# EAGLE design Touch Pad Board (PCB A) (EAGLE 6.1)
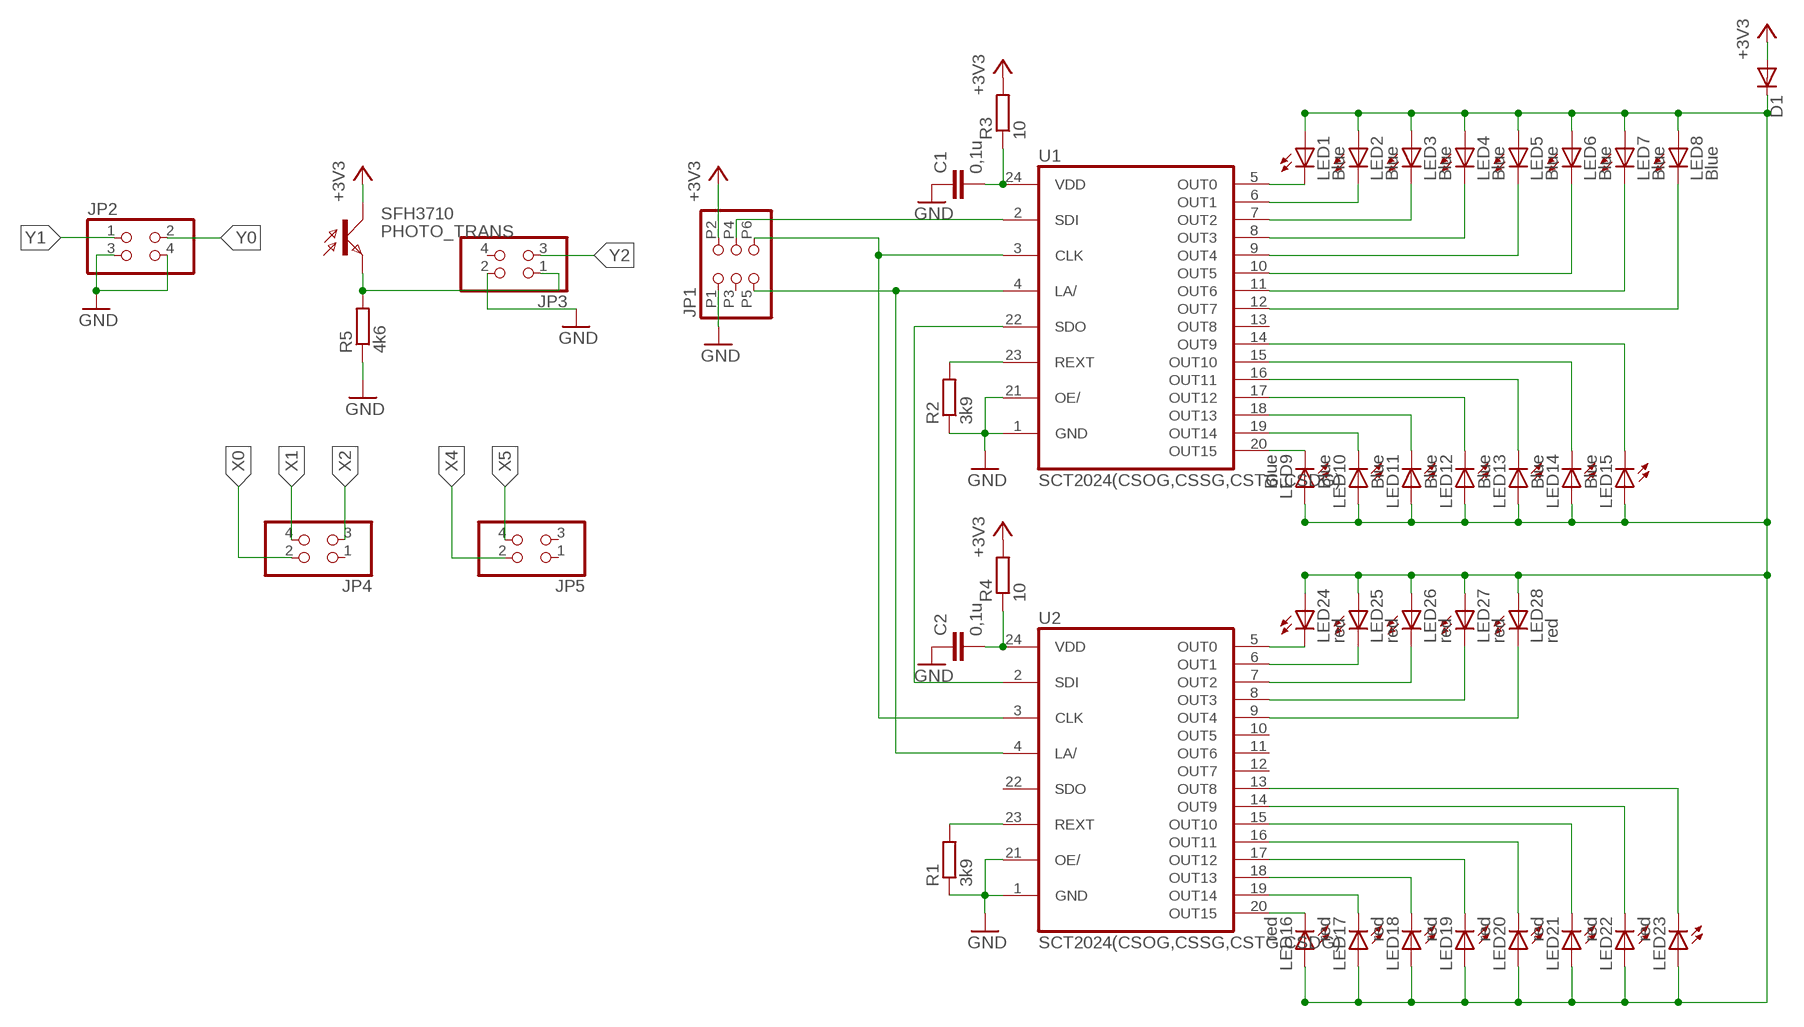
[diagram p0: schematic, sheet 1]

## Parts
C1  0,1u  C-EUC0805  [C0805]
C2  0,1u  C-EUC0805  [C0805]
D1  DIODE-DO214AC  [DO214AC]
JP1  PINHD-2X3SMD  [2X3SMD]
JP2  PINHD-2X2SMD  [2X2SMD]
JP3  PINHD-2X2SMD  [2X2SMD]
JP4  PINHD-2X2SMD  [2X2SMD]
JP5  PINHD-2X2SMD  [2X2SMD]
LED1  Blue  LEDCHIPLED_1206  [CHIPLED_1206]
LED2  Blue  LEDCHIPLED_1206  [CHIPLED_1206]
LED3  Blue  LEDCHIPLED_1206  [CHIPLED_1206]
LED4  Blue  LEDCHIPLED_1206  [CHIPLED_1206]
LED5  Blue  LEDCHIPLED_1206  [CHIPLED_1206]
LED6  Blue  LEDCHIPLED_1206  [CHIPLED_1206]
LED7  Blue  LEDCHIPLED_1206  [CHIPLED_1206]
LED8  Blue  LEDCHIPLED_1206  [CHIPLED_1206]
LED9  Blue  LEDCHIPLED_1206  [CHIPLED_1206]
LED10  Blue  LEDCHIPLED_1206  [CHIPLED_1206]
LED11  Blue  LEDCHIPLED_1206  [CHIPLED_1206]
LED12  Blue  LEDCHIPLED_1206  [CHIPLED_1206]
LED13  Blue  LEDCHIPLED_1206  [CHIPLED_1206]
LED14  Blue  LEDCHIPLED_1206  [CHIPLED_1206]
LED15  Blue  LEDCHIPLED_1206  [CHIPLED_1206]
LED16  red  LEDCHIPLED_1206  [CHIPLED_1206]
LED17  red  LEDCHIPLED_1206  [CHIPLED_1206]
LED18  red  LEDCHIPLED_1206  [CHIPLED_1206]
LED19  red  LEDCHIPLED_1206  [CHIPLED_1206]
LED20  red  LEDCHIPLED_1206  [CHIPLED_1206]
LED21  red  LEDCHIPLED_1206  [CHIPLED_1206]
LED22  red  LEDCHIPLED_1206  [CHIPLED_1206]
LED23  red  LEDCHIPLED_1206  [CHIPLED_1206]
LED24  red  LEDCHIPLED_1206  [CHIPLED_1206]
LED25  red  LEDCHIPLED_1206  [CHIPLED_1206]
LED26  red  LEDCHIPLED_1206  [CHIPLED_1206]
LED27  red  LEDCHIPLED_1206  [CHIPLED_1206]
LED28  red  LEDCHIPLED_1206  [CHIPLED_1206]
R1  3k9  R-EU_R0805  [R0805]
R2  3k9  R-EU_R0805  [R0805]
R3  10  R-EU_R0805  [R0805]
R4  10  R-EU_R0805  [R0805]
R5  4k6  R-EU_R0805  [R0805]
SFH3710  PHOTO_TRANS  [PHOTO_TRANS]
U1  SCT2024(CSOG,CSSG,CSTG,CSDG)  [24SSOP]
U2  SCT2024(CSOG,CSSG,CSTG,CSDG)  [24SSOP]

## Nets
+3V3: D1.A JP1.P2 R3.2 R4.2 SFH3710.A(C)
GND: C1.1 C2.1 JP1.P1 JP2.3 JP2.4 JP3.2 R1.1 R2.1 R5.1 U1.1(GND) U1.21(OE/) U2.1(GND) U2.21(OE/)
LED_DP: D1.C LED1.A LED2.A LED3.A LED4.A LED5.A LED6.A LED7.A LED8.A LED9.A LED10.A LED11.A LED12.A LED13.A LED14.A LED15.A LED16.A LED17.A LED18.A LED19.A LED20.A LED21.A LED22.A LED23.A LED24.A LED25.A LED26.A LED27.A LED28.A
N$1: LED1.C U1.5(OUT0)
N$2: LED2.C U1.6(OUT1)
N$3: LED3.C U1.7(OUT2)
N$4: LED4.C U1.8(OUT3)
N$5: LED5.C U1.9(OUT4)
N$6: LED6.C U1.10(OUT5)
N$7: LED7.C U1.11(OUT6)
N$8: LED8.C U1.12(OUT7)
N$9: LED24.C U2.5(OUT0)
N$10: LED25.C U2.6(OUT1)
N$11: LED26.C U2.7(OUT2)
N$12: LED27.C U2.8(OUT3)
N$13: LED28.C U2.9(OUT4)
N$17: LED16.C U2.20(OUT15)
N$18: LED17.C U2.19(OUT14)
N$19: LED18.C U2.18(OUT13)
N$20: LED19.C U2.17(OUT12)
N$21: LED20.C U2.16(OUT11)
N$22: LED21.C U2.15(OUT10)
N$23: LED22.C U2.14(OUT9)
N$24: LED23.C U2.13(OUT8)
N$25: R1.2 U2.23(REXT)
N$26: LED9.C U1.20(OUT15)
N$27: LED10.C U1.19(OUT14)
N$28: LED11.C U1.18(OUT13)
N$29: LED12.C U1.17(OUT12)
N$30: LED13.C U1.16(OUT11)
N$31: LED14.C U1.15(OUT10)
N$32: LED15.C U1.14(OUT9)
N$33: R2.2 U1.23(REXT)
N$34: U1.22(SDO) U2.2(SDI)
N$35: JP1.P5 U1.4(LA/) U2.4(LA/)
N$36: JP1.P6 U1.3(CLK) U2.3(CLK)
N$37: JP1.P4 U1.2(SDI)
N$38: C1.2 R3.1 U1.24(VDD)
N$39: C2.2 R4.1 U2.24(VDD)
OPTO: JP3.1 R5.2 SFH3710.C(E)
X0: JP4.2
X1: JP4.4
X2: JP4.3
X4: JP5.2
X5: JP5.4
Y0: JP2.2
Y1: JP2.1
Y2: JP3.3
Unconnected: JP1.P3 JP3.4 JP4.1 JP5.1 JP5.3 U1.13(OUT8) U2.10(OUT5) U2.11(OUT6) U2.12(OUT7) U2.22(SDO)

## Library data of the parts
C1 C2 = resistor:C-EU: CAPACITOR, European symbol
D1 = diode:DIODE-: DIODE
JP1 = pinhead:PINHD-2X3: PIN HEADER
JP2-JP5 = pinhead:PINHD-2X2: PIN HEADER
LED1-LED28 = led:LED: LED OSRAM: - CHIPLED LG R971, LG N971, LY N971, LG Q971, LY Q971, LO R971, LY R971 LH N974, LH R974 LS Q976, LO Q976, LY Q976 LO Q996 - Hyper CHIPLED LW Q18S LB Q993, LB Q99A, LB R99A - SideLED LS A670, LO A670, LY A670, LG A670, LP A670 LB A673, LV A673, LT A673, LW A673 LH A674 LY A675 LS A676, LA A676, LO A676, LY A676, LW A676 LS A679, LY A679, LG A679 - Hyper Micro SIDELED® LS Y876, LA Y876, LO Y876, LY Y876 LT Y87S - SmartLED LW L88C, LW L88S LB L89C, LB L89S, LG L890 LS L89K, LO L89K, LY L89K LS L896, LA L896, LO L896, LY L896 - TOPLED LS T670, LO T670, LY T670, LG T670, LP T670 LSG T670, LSP T670, LSY T670, LOP T670, LYG T670 LG T671, LOG T671, LSG T671 LB T673, LV T673, LT T673, LW T673 LH T674 LS T676, LA T676, LO T676, LY T676, LB T676, LH T676, LSB T676, LW T676 LB T67C, LV T67C, LT T67C, LS T67K, LO T67K, LY T67K, LW E67C LS E67B, LA E67B, LO E67B, LY E67B, LB E67C, LV E67C, LT E67C LW T67C LS T679, LY T679, LG T679 LS T770, LO T770, LY T770, LG T770, LP T770 LB T773, LV T773, LT T773, LW T773 LH T774 LS E675, LA E675, LY E675, LS T675 LS T776, LA T776, LO T776, LY T776, LB T776 LHGB T686 LT T68C, LB T68C - Hyper Mini TOPLED® LB M676 - Mini TOPLED Santana® LG M470 LS M47K, LO M47K, LY M47K Source: http://www.osram.convergy.de LUXEON: - LUMILED® LXK2-PW12-R00, LXK2-PW12-S00, LXK2-PW14-U00, LXK2-PW14-V00 LXK2-PM12-R00, LXK2-PM12-S00, LXK2-PM14-U00 LXK2-PE12-Q00, LXK2-PE12-R00, LXK2-PE12-S00, LXK2-PE14-T00, LXK2-PE14-U00 LXK2-PB12-K00, LXK2-PB12-L00, LXK2-PB12-M00, LXK2-PB14-N00, LXK2-PB14-P00, LXK2-PB14-Q00 LXK2-PR12-L00, LXK2-PR12-M00, LXK2-PR14-Q00, LXK2-PR14-R00 LXK2-PD12-Q00, LXK2-PD12-R00, LXK2-PD12-S00 LXK2-PH12-R00, LXK2-PH12-S00 LXK2-PL12-P00, LXK2-PL12-Q00, LXK2-PL12-R00 Source: www.luxeon.com KINGBRIGHT: KA-3528ASYC Source: www.kingbright.com
R1-R5 = resistor:R-EU_: RESISTOR, European symbol
SFH3710 = myHome:PHOTO_TRANS
U1 U2 = myHome:SCT2024(CSOG,CSSG,CSTG,CSDG)

## Board
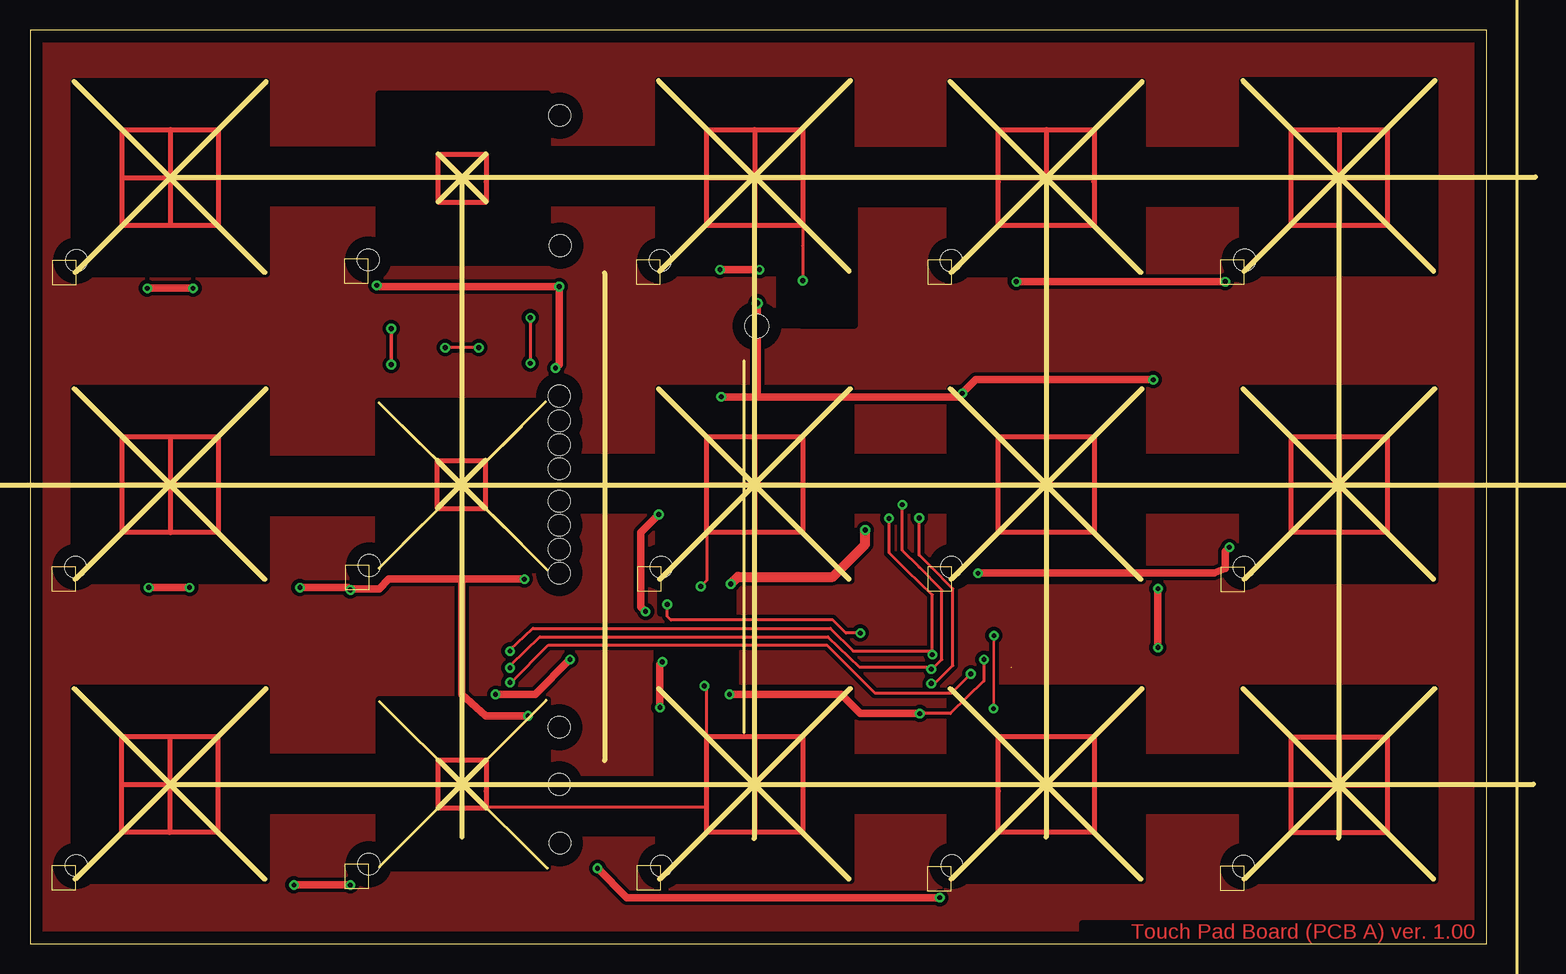
[diagram p1: board, top side]
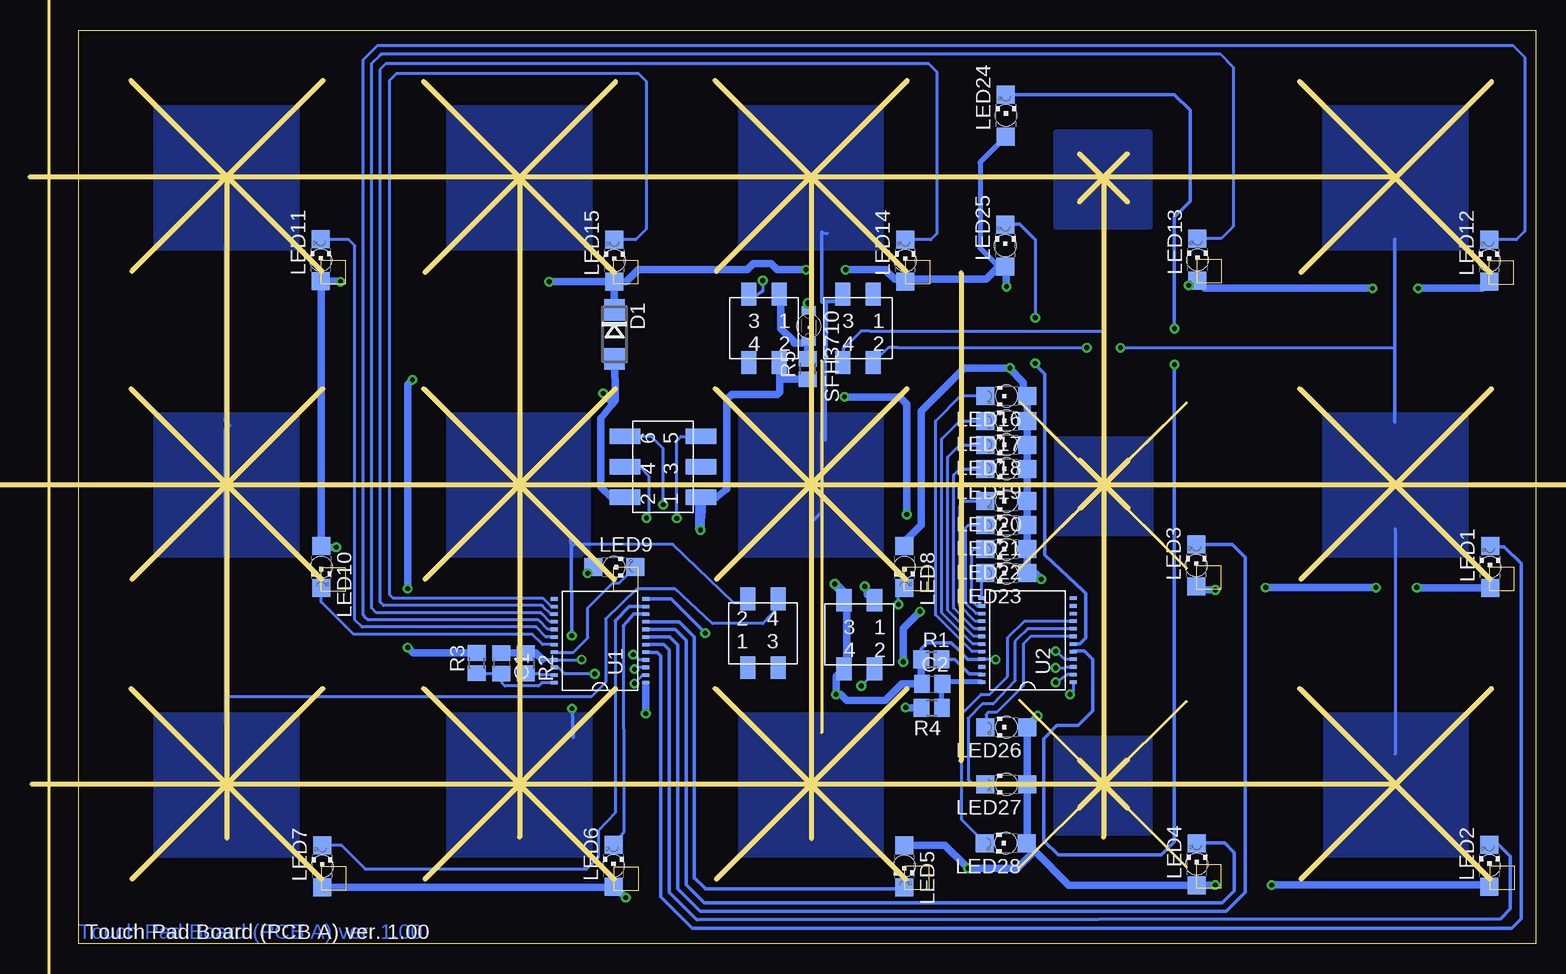
[diagram p2: board, bottom side, seen from below]

Size 121.39 x 76.2 mm. Coordinates in mm from the lower left corner, seen from the top.
Outline: 0,0 121.39,0 121.39,76.2 0,76.2 0,0
Copper layers (1*16): Top 0.035mm / dielectric 1.5mm / Bottom 0.035mm
Design rules: minimum track width 10mil, minimum drill 24mil, track to track 8mil, track to pad 8mil, pad to pad 8mil, via to via 8mil, smd to smd 8mil, copper to edge 40mil, drill to drill 8mil, minimum pad ring 10mil, minimum via ring 8mil, stop-mask expansion 4mil, vias tented up to drill 0mil, thermal gap 10mil
tRestrict: area 18,11.2 to 31.5,15.6; area 29.1,6.3 to 43.1,20.3; area 29.1,31.2 to 43.1,45.2; area 29.1,56.8 to 43.1,70.8; area 3.7,5.3 to 19.7,21.3; area 3.7,30.3 to 19.7,46.3; area 3.7,55.9 to 19.7,71.9; area 52.4,5.3 to 68.4,21.3; area 52.4,30.3 to 68.4,46.3; area 52.4,56 to 68.4,72; area 76.7,55.9 to 92.7,71.9; area 76.7,30.3 to 92.7,46.3; 22 more areas
Milling: area 1.8,4.5 to 3.8,6.5; area 26.2,4.6 to 28.2,6.6; area 50.6,4.5 to 52.6,6.5; area 74.8,4.4 to 76.8,6.4; area 99.2,4.5 to 101.2,6.5; area 1.8,29.4 to 3.8,31.4; area 26.3,29.5 to 28.3,31.5; area 50.6,29.4 to 52.6,31.4; area 74.8,29.4 to 76.8,31.4; area 99.2,29.4 to 101.2,31.4; area 1.9,55 to 3.9,57; area 26.2,55.1 to 28.2,57.1; 3 more areas; 47 lines

### Footprints (pad centres in the part's own frame; a part is rotated, then mirrored left to right if it is on the bottom)
C0805 = smd 1.3 x 1.5: 1 -0.85,0; 2 0.85,0
DO214AC = smd 1.8 x 1.7: A 2.05,0; C -2.05,0
2X3SMD = smd 1.27 x 2.54: P1 -3.175,-3.175; P2 -3.175,3.175; P3 -0.635,-3.175; P4 -0.635,3.175; P5 1.905,-3.175; P6 1.905,3.175
2X2SMD = smd 0.635 x 1.27: 1 -0.635,-2.54; 2 -0.635,2.54; 3 1.905,-2.54; 4 1.905,2.54; P$1 0,2.54; P$2 2.54,2.54; P$4 0,-2.54; P$5 2.54,-2.54; P$9 2.54,3.175; P$10 1.905,3.175; P$11 0,3.175; P$12 -0.635,3.175; P$13 -0.635,-3.175; P$14 0,-3.175; P$15 1.905,-3.175; P$16 2.54,-3.175
CHIPLED_1206 = smd 1.5 x 1.5: A 0,-1.75; C 0,1.75 | hole 1.8: 0,0
R0805 = smd 1.3 x 1.5: 1 -0.85,0; 2 0.85,0
PHOTO_TRANS = smd 1.2 x 1.2: A 0,-1.05; C 0,1.05 | hole 2: 0,0
24SSOP = smd 0.305 x 0.61: 1 -3.493,-3.81; 2 -2.857,-3.81; 3 -2.223,-3.81; 4 -1.587,-3.81; 5 -0.953,-3.81; 6 -0.318,-3.81; 7 0.318,-3.81; 8 0.953,-3.81; 9 1.587,-3.81; 10 2.223,-3.81; 11 2.857,-3.81; 12 3.493,-3.81; 13 3.493,3.81; 14 2.857,3.81; 15 2.223,3.81; 16 1.587,3.81; 17 0.953,3.81; 18 0.318,3.81; 19 -0.318,3.81; 20 -0.953,3.81; 21 -1.587,3.81; 22 -2.223,3.81; 23 -2.857,3.81; 24 -3.493,3.81

### Placement (x,y rotation side)
C1  86.18,23.39 270 bottom
C2  50.3,21.67 0 bottom
D1  76.77,50.83 270 bottom
JP1  72.72,40.42 90 bottom
JP2  55.41,25.8 180 bottom
JP3  63.35,51.33 180 bottom
JP4  55.51,51.33 180 bottom
JP5  65.34,25.89 0 bottom
LED1  3.8,31.41 0 bottom
LED2  3.85,6.53 0 bottom
LED3  28.28,31.55 0 bottom
LED4  28.23,6.65 0 bottom
LED5  52.62,6.49 180 bottom
LED6  76.84,6.5 0 bottom
LED7  101.12,6.46 0 bottom
LED8  52.6,31.41 180 bottom
LED9  76.8,31.41 270 bottom
LED10  101.2,31.41 180 bottom
LED11  101.24,57 0 bottom
LED12  3.87,56.96 0 bottom
LED13  28.18,57.04 0 bottom
LED14  52.53,56.97 0 bottom
LED15  76.77,56.96 0 bottom
LED16  44.1,45.68 90 bottom
LED17  44.1,43.61 90 bottom
LED18  44.1,41.61 90 bottom
LED19  44.1,39.61 90 bottom
LED20  44.1,36.91 90 bottom
LED21  44.1,34.91 90 bottom
LED22  44.1,32.91 90 bottom
LED23  44.1,30.91 90 bottom
LED24  44.14,69.07 0 bottom
LED25  44.19,58.22 0 bottom
LED26  44.1,18.07 90 bottom
LED27  44.1,13.31 90 bottom
LED28  44.16,8.4 90 bottom
R1  50.35,23.71 0 bottom
R2  84.14,23.4 270 bottom
R3  88.23,23.41 90 bottom
R4  50.32,19.66 180 bottom
R5  60.66,47.94 90 bottom
SFH3710  60.57,51.52 180 bottom
U1  77.97,25.27 90 bottom
U2  42.34,25.32 90 bottom

### Tracks (layer width: path | path; a pad name or v marks a point on that pad's centre or on a via)
+3V3  (via drill 0.4, 0.5)
  Top 0.61: v94,24.71 v94,29.61 | v93.6,47.04 78.83,47.04 v77.7,45.91 77.4,45.61 60.58,45.61 | v52.5,19.71 52.5,23.31 v52.7,23.51 | v51.3,27.71 50.9,28.11 50.9,34.31 v52.4,35.81 | v57.6,45.61 60.58,45.61 | v60.6,53.41 60.6,45.63 60.58,45.61
  Bottom 0.61: JP1.P2 77.03,37.25 77.9,38.11 77.9,43.81 76.93,45.02 | 76.93,45.02 76.7,45.31 76.7,46.64 D1.A | R3.2 93.55,24.26 v94,24.71 | v94,29.61 94,46.64 v93.6,47.04 | v77.7,45.91 76.9,45.11 76.9,45.05 76.93,45.02 | R4.2 52.45,19.66 v52.5,19.71 | v52.7,23.51 52.7,26.31 v51.3,27.71 | v52.4,35.81 52.4,45.01 53,45.61 v57.6,45.61 | SFH3710.A 60.57,53.38 v60.6,53.41
GND  (via drill 0.4)
  Top 0.254: v79.5,23.71 79.5,21.91 76.7,19.21 74.3,19.21 | 74.3,19.21 74.26,19.21 | 74.26,19.21 v74.15,19.2 | 74.26,19.21 74.3,19.21
  Top 0.61: v38.8,20.81 42.1,20.81 v45,23.71 | 74.3,19.21 74.26,19.21 69.2,19.21 67.6,20.81 59.1,20.81 v58.3,20.81
  Top 0.813: v58.4,30.01 59,30.61 66.9,30.61 69.6,33.31 v69.6,34.51
  Bottom 0.254: C1.1 | R2.1 83.34,24.25 | 82.8,23.71 81.81,23.71 U1.21 79.43,23.68 v79.5,23.71 | U2.1 38.53,21.08 v38.8,20.81 | v45,23.71 46.13,23.71 U2.21 | 57.4,23.21 57.35,23.26 JP2.4
  Bottom 0.305: U2.21 47.32,23.73 48,24.41 48.7,25.11 50.7,25.11 51.2,24.61 R1.1 | U1.1 74.16,21.49
  Bottom 0.61: R2.1 C1.1 | 83.34,24.25 82.8,23.71 | JP2.3 57.67,28.24 57.7,28.21 57.61,28.13 57.4,27.91 57.4,23.21 58.3,22.31 v58.3,20.81 57.9,20.81 57.61,20.53 57.4,20.31 54.2,20.31 52.84,21.67 C2.1 51.2,21.72 R1.1 | JP1.P1 69.61,37.21 68.3,37.21 67.4,37.91 67.4,45.41 67,45.81 63.2,45.81 63,46.01 63,47.11 | 74.16,21.49 v74.15,19.2 | 63,47.11 63,48.19 63.12,48.31 | 63.12,48.31 63,48.31 62.9,48.41 | JP3.2 62.94,48.49 63.12,48.31 | R5.1 62.98,47.09 63,47.11
  Bottom 0.813: 57.67,28.24 57.67,29.28 v58.4,30.01 | v69.6,34.51 69.6,35.61 | 69.6,35.61 69.6,35.71 69.6,37.01 | JP1.P1 69.54,36.94 69.6,35.61
LED_DP  (via drill 0.4)
  Top 0.61: v43.8,48.01 44.1,48.31 v44.1,54.81 29,54.81 v28.9,54.91 | v9.78,54.66 v13.59,54.66 | v57.5,56.21 v60.8,56.21 | v82.2,55.21 v99.6,55.21 | v22,4.91 v26.7,4.91 | v9.9,29.71 13.2,29.71 v13.3,29.71 | v22.5,29.71 26.5,29.71 v26.7,29.51 26.8,29.61 29.1,29.61 29.9,30.41 36,30.41 | v41.2,30.41 37,30.41 | 37,30.41 36,30.41 | v75.82,3.86 49.75,3.86 v47.3,6.31 | v79,30.91 98.7,30.91 99.6,31.31 99.6,32.72 v99.95,33.07 | v41.5,19.01 38,19.01 36,20.81 36,30.41 | 36,30.41 37,30.41
  Bottom 0.254: LED25.A 44.19,56.02 44.1,55.93
  Bottom 0.406: LED24.A 46.3,65.16 46.3,58.01 44.76,56.47 LED25.A
  Bottom 0.61: LED19.A LED18.A LED17.A LED16.A 42.7,46.03 42.7,46.81 43.8,47.91 v43.8,48.01 47.6,48.01 51.2,44.41 51.2,34.91 52.6,33.51 LED8.A | LED7.A 76.88,4.71 LED6.A 76.71,4.75 v75.82,3.86 | LED4.A 28.83,4.9 | 28.83,4.9 38.91,4.9 41.76,7.75 | 41.76,7.75 LED28.A 42.35,8.46 LED27.A LED26.A 42.35,18.16 v41.5,19.01 | LED25.A 44.74,56.47 45.8,55.41 52.34,55.41 LED14.A 52.72,55.41 53.4,55.41 54.1,56.11 54.1,56.21 v57.5,56.21 | D1.C 76.77,55.08 76.8,55.11 | v44.1,54.81 44.1,55.93 44.1,56.51 | LED12.A 4.42,54.66 v9.78,54.66 | v13.59,54.66 27.56,54.66 LED13.A 28.56,54.91 v28.9,54.91 | v60.8,56.21 63.2,56.21 63.7,56.71 65.2,56.71 65.7,56.21 66,56.21 74.8,56.21 75.8,55.21 LED15.A 76.77,55.14 76.8,55.11 | 76.8,55.11 76.9,55.21 v82.2,55.21 | v99.6,55.21 99.64,55.25 LED11.A 101.28,55.21 101.3,55.21 101.22,55.29 101.22,54.73 101.2,55.21 LED10.A 101.22,33.14 101.22,33.07 v99.95,33.07 | LED2.A 3.98,4.91 v22,4.91 | v26.7,4.91 v26.71,4.9 28.83,4.9 | LED5.A 49.23,8.24 47.63,6.65 | 47.63,6.65 v47.3,6.31 | v47.3,6.31 43.2,6.31 41.76,7.75 | LED1.A 9.85,29.66 v9.9,29.71 | v13.3,29.71 v22.5,29.71 | v26.7,29.51 28,29.51 28.3,29.81 LED3.A | v41.2,30.41 41.7,30.91 LED23.A LED22.A LED21.A LED20.A LED19.A | LED19.A 42.35,39.76 42.3,39.81 42.3,39.71 42.3,39.66 LED19.A | v47.3,6.31 47.63,6.65 | LED9.A 78.65,31.36 v79,30.91
N$1
  Bottom 0.305: U1.5 73.21,24.32 73,24.11 72.9,24.01 72.9,5.21 72.9,3.91 70.3,1.31 2,1.31 1.2,2.11 1.2,31.71 2.6,33.11 3.43,33.11 | 3.43,33.11 3.8,33.11 | LED1.C 3.75,33.11 3.43,33.11
N$2
  Bottom 0.305: U1.6 72.64,24.95 72.2,24.51 72.2,5.91 72.2,4.31 69.9,2.01 2.9,2.11 2.1,2.91 2.1,7.31 3.07,8.28 LED2.C 3.82,8.31
N$3
  Bottom 0.305: U1.7 72.68,25.59 72.18,25.59 71.5,24.91 71.5,5.51 71.5,4.61 69.6,2.71 67.2,2.71 | 67.3,2.71 67.2,2.71 | 67.2,2.71 25.79,2.71 25.79,2.72 24.2,4.31 24.2,32.21 25.3,33.31 28.6,33.31 28.6,33.3 | 28.6,33.3 28.83,33.07 | 28.6,33.3 LED3.C
N$4
  Bottom 0.305: U1.8 72.11,26.22 71.71,26.22 70.8,25.31 70.8,4.91 69.3,3.41 67.5,3.41 | 67.66,3.41 67.5,3.41 | 67.5,3.41 26.4,3.41 26.1,3.41 25.1,4.41 25.1,4.91 | LED4.C 25.9,8.41 25.1,7.61 25.1,4.91 | 25.1,4.71 25.1,4.91
N$5
  Bottom 0.305: U1.9 71.65,26.86 71.35,26.86 70.1,25.61 70.1,5.51 | 70.1,5.51 70.1,5.48 70.1,5.51 | 52.8,4.81 52.77,4.78 52.77,4.74 LED5.C 52.75,4.61 69.2,4.61 69.3,4.71 70.1,5.51
N$6
  Bottom 0.254: 76.03,26.53 76,9.31 76.9,8.01 76.9,8.19 LED6.C
  Bottom 0.305: U1.10 75.15,27.49 76.03,26.53
N$7
  Bottom 0.254: 76.7,26.91 76.7,20.91 76.7,10.91 78.1,9.41 78.1,7.21 78.6,6.71 79.1,6.21 97.5,6.21 99.5,8.21 101.1,8.21 101.1,7.79 101.22,7.67 101.12,7.77 LED7.C
  Bottom 0.305: U1.11 75.51,28.13 76.7,26.91
N$8  (via drill 0.4)
  Top 0.254: v69.2,25.91 68,25.91 66.9,27.01 53.4,27.01 53.1,27.31 v53.1,28.31
  Bottom 0.254: 53.2,29.02 52.96,29.26 52.96,29.3 | 52.96,29.3 LED8.C | v53.1,28.31 53.1,29.16 52.96,29.3
  Bottom 0.305: U1.12 72.05,28.76 v69.2,25.91
N$9  (via drill 0.4)
  Top 0.305: v30.1,51.31 v30.1,48.31
  Bottom 0.254: 30.1,34.71 30.1,34.34 30.1,34.71
  Bottom 0.305: LED24.C 30.11,70.82 28.8,69.51 28.8,61.91 30.1,60.61 v30.1,51.31 | U2.5 38.54,24.37 38.6,24.31 38.5,24.41 37.6,24.41 36.9,23.71 36.9,19.41 38.1,18.21 39.9,18.21 41,17.11 41,8.61 39.8,7.41 31.2,7.41 30.1,8.51 30.1,34.34 30.1,34.71 v30.1,48.31
N$10  (via drill 0.4)
  Top 0.254: v41.7,52.21 v41.7,48.41
  Bottom 0.254: 41.7,58.71 v41.7,52.21 | v41.7,48.41 41.7,48.31
  Bottom 0.305: U2.6 38.01,25 37.5,25.51 37.5,29.21 37.7,29.41 40.9,32.41 40.9,47.51 41.7,48.31 | 41.7,58.71 43,60.01 44.15,60.01 LED25.C
N$11
  Bottom 0.254: U2.7 42.07,25.64 42.7,25.01 42.7,21.51 44.9,19.31 45.6,19.31 45.8,19.11 45.8,17.91 45.8,18.02 LED26.C
N$12
  Bottom 0.254: U2.8 42.34,26.27 43.2,25.41 43.4,25.21 43.4,21.91 45.2,20.01 46.1,20.01 47.3,18.81 47.3,13.71 46.9,13.31 LED27.C
N$13
  Bottom 0.254: U2.9 42.61,26.91 43.97,25.55 44,25.38 44,22.31 45.5,20.81 46.2,20.81 47.88,19.13 47.88,19.1 47.88,10.39 LED28.C 45.37,8.94 45.34,8.94 45.88,8.4 LED28.C
N$14
  pour Top (isolate 0.305): 0,76.2 120.89,76.2 120.89,0 0,0
N$17
  Bottom 0.254: U2.20 46.96,24.37 50,27.41 50,43.61 47.9,45.71 45.88,45.71 LED16.C
N$18
  Bottom 0.254: U2.19 46.89,25 49.5,27.61 49.5,42.11 48,43.61 LED17.C
N$19
  Bottom 0.254: U2.18 46.83,25.64 49,27.81 49,40.61 48,41.61 LED18.C
N$20
  Bottom 0.254: U2.17 46.76,26.27 48.5,28.01 48.5,39.11 48,39.61 LED19.C
N$21
  Bottom 0.254: U2.16 46.7,26.91 48,28.21 48,36.51 47.6,36.91 LED20.C
N$22
  Bottom 0.254: U2.15 46.63,27.54 47.4,28.31 47.5,28.41 47.5,34.71 47.3,34.91 LED21.C
N$23
  Bottom 0.254: U2.14 46.57,28.18 46.9,28.51 47,28.61 47,32.71 46.8,32.91 LED22.C
N$24
  Bottom 0.254: U2.13 46.15,30.66 45.9,30.91 LED23.C
N$25
  Bottom 0.305: R1.2 48.4,23.71 47.2,22.51 46.2,22.51 U2.23
N$26
  Bottom 0.254: U1.20 80.79,24.32 80.19,24.32 79,25.51 | 79,25.61 79,25.51 | 79,25.51 79,25.61 | 79,25.61 79,28.01 76.9,30.11 76.35,30.11 LED9.C
N$27
  Bottom 0.254: U1.19 82.74,24.95 82.8,25.01 83.6,25.81 98.5,25.81 99.2,26.51 101.2,28.51 LED10.C
N$28
  Bottom 0.254: U1.18 82.48,25.59 83.3,26.41 95.3,26.41 97.8,26.41 98.4,27.01 98.4,58.21 98.9,58.71 101.2,58.71 | 101.2,58.71 LED11.C | LED11.C 101.3,58.81 | LED11.C 101.2,58.71 | 101.2,58.71 LED11.C
N$29
  Bottom 0.254: 82.01,26.22 U1.17 82.31,26.22 83,26.91 83.1,27.01 97.3,27.01 97.6,27.31 97.7,27.41 97.7,73.71 96.5,74.91 1.9,74.91 0.9,73.91 0.9,59.74 | 0.9,59.74 0.9,59.41 1.6,58.71 LED12.C | LED12.C 3.9,58.71 | 0.9,59.74 0.89,59.74 0.9,59.74 | 3.43,58.47 LED12.C
N$30
  Bottom 0.254: U1.16 82.15,26.86 82.8,27.51 82.9,27.61 96.6,27.61 97,28.01 97,73.41 96.3,74.11 96.2,74.21 26.3,74.21 25.2,73.11 25.2,59.81 26.2,58.81 28.1,58.81 | 28.1,58.81 28.2,58.71 | 28.1,58.81 28.16,58.81 LED13.C
N$31
  Bottom 0.254: U1.15 82.08,27.49 82.7,28.11 82.8,28.21 96,28.21 96.3,28.51 96.3,72.91 95.8,73.41 50.6,73.41 49.9,72.71 49.9,59.21 50.4,58.71 LED14.C
N$32
  Bottom 0.254: U1.14 82.02,28.13 82.6,28.71 82.7,28.81 95.2,28.81 95.5,29.11 95.5,72.01 94.9,72.61 74.8,72.61 74.1,71.91 74.1,59.61 75,58.71 LED15.C
N$33
  Bottom 0.254: U1.23 82.9,22.41 83,22.51 84.1,22.51 R2.2
N$34  (via drill 0.4)  (1 unrouted)
  Top 0.254: v40,21.81 40.1,21.81 43.2,24.91 66.4,24.91 70.4,20.91 76.8,20.91 v78.4,22.51
  Bottom 0.254: U2.2 39.05,22.46 v40,21.81 | v78.4,22.51 80.9,22.51 81.4,23.01 81.8,23.01
N$35  (via drill 0.4)
  Top 0.254: v75.2,24.11 75.2,29.11 73.1,31.11 71.6,32.61 71.6,35.51 v71.58,35.49 v71.58,35.48 71.6,35.3 | 74.9,24.41 v75.2,24.11 | v40,24.41 40,24.51 41.9,26.31 66.7,26.31 68.6,24.41 75,24.41 | 75,24.41 75.3,24.11 | 75,24.41 75,24.31 v75.2,24.11
  Bottom 0.254: U1.4 74.67,23.68 v75.2,24.11 | U2.4 39.22,23.73 v40,24.41 | 69.6,42.31 71.2,42.31 71.58,41.93 v71.58,35.48 | 69.6,42.31 69.5,42.31 69.6,42.31 | 69.6,42.31 JP1.P5
N$36  (via drill 0.4)
  Top 0.254: v40,23.01 40.1,22.91 40.1,23.31 42.5,25.61 66.5,25.61 69.1,23.11 75,23.11 75.1,23.01 v75.1,22.91 | v75.1,22.91 75.15,22.91 | 75.15,22.91 75.2,22.91 | 75.2,22.91 76,23.71 76,29.51 74.1,31.41 72.7,32.81 v72.7,36.61 | 75.15,22.91 v75.1,22.91 | v75.1,22.91 75.15,22.91 | 75.15,22.91 75.2,22.91 | 75.2,22.91 75.15,22.91 | 75.15,22.91 v75.1,22.91 | v75.1,22.91 75.15,22.91 | v75.1,22.91 75.15,22.91
  Bottom 0.254: U1.3 74.96,23.05 | 74.96,23.05 v75.1,22.91 74.96,23.05 | v40,23.01 39.2,23.01 39.1,23.11 38.54,23.11 U2.3 | v72.7,36.61 72.7,41.31 73.7,42.31 76,42.31 75.91,42.31 JP1.P6
N$37  (via drill 0.4)
  Top 0.254: v75.1,21.71 75.4,21.71 76.9,23.21 76.9,29.61 75.1,31.41 74.1,32.41 v74.1,35.51
  Bottom 0.254: U1.2 74.4,22.41 v75.1,21.71 | JP1.P4 74.67,39.79 73.9,39.01 73.9,35.71 v74.1,35.51
N$38
  Bottom 0.254: U1.24 82.83,21.78 83.1,21.51 85.9,21.51 86.1,21.71 86.1,22.41 86.2,22.51 | 86.2,22.51 86.3,22.51 88.2,22.51 88.25,22.56 | 88.25,22.56 88.3,22.61 | C1.2 86.2,22.51 | R3.1 88.25,22.56
N$39
  Bottom 0.406: U2.24 49.28,21.83 49.5,21.61 49.18,21.61 49.15,21.64 49.18,21.67 C2.2 49.47,21.65 R4.1
OPTO
  Bottom 0.61: R5.2 60.66,50.38 SFH3710.C 60.74,50.47 61.1,50.11 61.8,50.11 61.8,50.21 62.9,51.31 62.9,53.56 JP3.1
X0  (via drill 0.4)
  Top 0.254: v37.4,49.71 v34.6,49.71
  Bottom 0.254: 11.7,34.61 11.7,15.81 | 53.15,49.71 53.2,49.71 | 53.2,49.71 v37.4,49.71 | v34.6,49.71 11.75,49.71 | 53.2,49.71 53.95,49.71 JP4.2
  Bottom 0.305: 11.75,43.53 11.75,49.71 11.75,58.77
  pour Bottom: 5.74,19.11 17.54,19.11 17.54,7.41 5.74,7.41
  pour Bottom: 5.8,69.71 17.6,69.71 17.6,58.01 5.8,58.01
  pour Bottom: 5.8,44.11 17.6,44.11 17.6,32.41 5.8,32.41
X1
  Bottom 0.254: 36,41.91 36,51.11 55.5,51.11 56.2,51.11 57.7,49.61 57.7,48.51 JP4.4
  Bottom 0.305: 36,17.01 36,34.61 | 36,41.91 36,51.11 36,60.21
  pour Bottom: 32.12,17.14 40.01,17.14 40.01,9.25 32.12,9.25
  pour Bottom: 32.05,42.11 39.94,42.11 39.94,34.22 32.05,34.22
  pour Bottom: 32.12,67.67 40.01,67.67 40.01,59.78 32.12,59.78
X2
  Bottom 0.254: 59.5,59.34 59.03,59.24 | JP4.3 58.06,53.57 59.5,53.61
  Bottom 0.305: 60.4,17.21 60.4,35.11 59.5,36.01 59.5,42.54 | 58.2,53.54 59.5,53.51 | 59.5,53.51 59.5,53.61 | 59.5,53.61 59.5,53.51 | 59.5,53.51 58.2,53.54 | 59.5,53.61 59.5,59.34 | 58.2,53.54 59.5,53.51 | 59.5,53.51 59.1,53.51 59.1,49.91 59.2,48.71 59.2,42.01 | 59.5,53.61 57.8,53.61 57.7,53.51
  pour Bottom: 54.5,19.11 66.3,19.11 66.3,7.41 54.5,7.41
  pour Bottom: 54.5,44.11 66.3,44.11 66.3,32.41 54.5,32.41
  pour Bottom: 54.5,69.71 66.3,69.71 66.3,58.01 54.5,58.01
X4  (via drill 0.4)
  Top 0.203: v80.33,25.7 v80.3,19.61
  Bottom 0.254: 84.7,60.01 84.7,42.11 | JP5.2 66.82,28.43 71.9,33.31 80.12,33.31 80.38,33.05
  Bottom 0.305: v80.3,19.61 80.2,17.21 | v80.33,25.7 80.38,33.05 80.4,33.71
  pour Bottom: 78.8,19.11 90.6,19.11 90.6,7.41 78.8,7.41
  pour Bottom: 78.9,44.11 90.6,44.11 90.6,32.41 78.9,32.41
  pour Bottom: 78.8,69.71 90.6,69.71 90.6,58.01 78.8,58.01
X5
  Bottom 0.254: 109.2,32.41 109.2,20.51 | 109.2,20.51 109.2,18.41 | 109.2,58.11 109.2,43.81 | JP5.4 63.13,28.08 64.39,26.72 68.61,26.72 71.7,29.61 74.9,29.61 77.5,27.11 77.5,21.81 78.7,20.61 109.1,20.61 109.2,20.51
  Bottom 0.305: 109.2,32.41 109.2,42.87 108.84,43.23 109.2,43.59 109.2,43.81
  pour Bottom: 103.2,19.08 115,19.08 115,7.38 103.2,7.38
  pour Bottom: 103.2,44.11 115,44.11 115,32.41 103.2,32.41
  pour Bottom: 103.2,69.71 115,69.71 115,58.01 103.2,58.01
Y0  (via drill 0.4)
  Top 0.203: 15.6,13.31 16.13,13.31 | 16.13,13.31 34,13.31 34,12.76 34.01,12.75 | 15.63,13.3 16.12,13.3 16.13,13.31 | 64.3,13.31 64.39,13.31 | 64.39,13.31 80.7,13.31 80.7,12.76 80.69,12.75 | 88.7,13.31 105,13.31 105.04,13.27 105.09,13.27 | 38,13.31 38,12.76 38.01,12.75 | 56.39,13.3 56.4,13.31 | 64.39,13.3 64.39,13.31
  Top 0.254: 56.39,17.3 56.39,21.32 v56.2,21.51 | 38,13.31 38,12.31 38,11.41 56.3,11.41 56.4,11.51 56.4,13.31 | 88.72,13.29 88.69,13.29 | 88.69,13.29 88.72,13.29 | 88.72,13.29 105.03,13.29 105.09,15.29 | 88.72,13.29 88.69,13.29
  Top 0.406: 7.63,13.3 7.63,9.3 11.63,9.3 | 7.63,13.3 7.63,17.3 11.63,17.3 | 11.63,17.3 15.63,17.3 15.63,13.3 | 11.63,9.3 15.63,9.3 15.63,13.3 | 7.63,13.3 15.63,13.3 | 11.63,17.3 11.63,9.3 | 37.91,11.33 34.01,11.33 34.01,12.75 34.01,15.33 38.01,15.33 38.01,12.75 38.01,11.33 | 37.91,11.33 38.01,11.33 | 38.01,11.33 37.91,11.33 | 56.39,13.3 56.39,9.3 60.39,9.3 | 56.39,13.3 56.39,17.3 60.39,17.3 | 60.39,17.3 64.39,17.3 64.39,13.31 64.39,13.3 | 60.39,9.3 64.39,9.3 64.39,13.3 | 56.39,13.3 64.39,13.3 | 60.39,17.3 60.39,9.3 | 80.69,13.3 80.69,12.75 80.69,9.3 84.69,9.3 | 80.69,13.3 80.69,17.3 84.69,17.3 | 84.69,17.3 88.69,17.3 88.69,13.29 88.69,9.3 84.69,9.3 | 80.69,13.3 88.69,13.3 | 84.69,17.3 84.69,9.3 | 105.09,13.27 105.09,9.27 109.09,9.27 | 105.09,13.27 105.09,15.29 105.09,17.27 109.09,17.27 | 109.09,17.27 113.09,17.27 113.09,9.27 109.09,9.27 | 105.09,13.27 113.09,13.27 | 109.09,17.27 109.09,9.27
  Bottom 0.254: v56.2,21.51 55.3,22.41 55.3,22.91 | 55.3,22.91 55.1,23.11 | JP2.2 55.07,23.14 55.3,22.91
Y1  (via drill 0.4)
  Top 0.203: 15.7,38.31 16.13,38.31 | 16.13,38.31 33.9,38.31 33.9,38.19 33.94,38.15 | 105.09,38.3 105.09,38.21 105.03,38.15 105.03,38.28 105,38.31 88.7,38.31 88.69,38.3 | 80.9,38.3 80.89,38.31 80.7,38.31 64.4,38.31 64.39,38.3 | 56.39,38.3 56.31,38.3 56.3,38.31 37.9,38.31 37.9,38.19 37.94,38.15 | 15.69,38.3 16.12,38.3 16.13,38.31
  Top 0.254: 56.39,34.3 56.39,30.3 v55.9,29.81
  Top 0.406: 7.69,38.3 7.69,34.3 11.69,34.3 | 7.69,38.3 7.69,42.3 11.69,42.3 | 11.69,42.3 15.69,42.3 15.69,38.3 | 11.69,34.3 15.69,34.3 15.69,38.3 | 7.69,38.3 15.69,38.3 | 11.69,42.3 11.69,34.3 | 37.84,36.3 33.94,36.3 33.94,38.15 33.94,40.3 37.94,40.3 37.94,38.15 37.94,36.3 | 37.84,36.3 37.94,36.3 | 37.94,36.3 37.84,36.3 | 56.39,38.3 56.39,34.3 60.39,34.3 | 56.39,38.3 56.39,42.3 60.39,42.3 | 60.39,42.3 64.39,42.3 64.39,38.3 | 60.39,34.3 64.39,34.3 64.39,38.3 | 56.39,38.3 64.39,38.3 | 60.39,42.3 60.39,34.3 | 80.69,38.3 80.69,34.3 84.69,34.3 | 80.69,38.3 80.69,42.3 84.69,42.3 | 84.69,42.3 88.69,42.3 88.69,38.3 | 84.69,34.3 88.69,34.3 88.69,38.3 | 80.69,38.3 80.9,38.3 88.69,38.3 | 84.69,42.3 84.69,34.3 | 105.09,38.3 105.09,34.3 109.09,34.3 | 105.09,38.3 105.09,42.3 109.09,42.3 | 109.09,42.3 113.09,42.3 113.09,34.3 109.09,34.3 | 105.09,38.3 113.09,38.3 | 109.09,42.3 109.09,34.3
  Bottom 0.254: v55.9,29.81 55.9,29.07 JP2.1
Y2  (via drill 0.4)
  Top 0.203: 15.6,63.91 16.13,63.91 | 16.13,63.91 33.9,63.91 33.9,63.66 34.01,63.55 | 105.03,63.91 88.7,63.91 88.7,63.73 88.52,63.55 88.69,63.55 | 105.03,63.91 105.2,63.91 | 15.69,63.9 16.12,63.9 16.13,63.91 | 38.01,63.55 38,63.56 38,64.01 56.4,64.01 56.39,64 56.39,63.9 | 64.39,63.9 64.4,63.91 80.9,63.91 80.6,63.66 80.69,63.55 | 105.09,63.9 105.04,63.9 105.03,63.91
  Top 0.254: 64.39,59.9 64.39,58.22 v64.4,55.31
  Top 0.406: 7.69,63.9 7.69,59.9 11.69,59.9 | 7.69,63.9 7.69,67.9 11.69,67.9 | 11.69,67.9 15.69,67.9 15.69,63.9 | 11.69,59.9 15.69,59.9 15.69,63.9 | 7.69,63.9 15.69,63.9 | 11.69,67.9 11.69,59.9 | 37.91,61.86 34.01,61.86 34.01,63.55 34.01,65.86 38.01,65.86 38.01,63.55 38.01,61.86 | 37.91,61.86 38.01,61.86 | 38.01,61.86 37.91,61.86 | 56.39,63.9 56.39,59.9 60.39,59.9 | 56.39,63.9 56.39,67.9 60.39,67.9 | 60.39,67.9 64.39,67.9 64.39,63.9 | 60.39,59.9 64.39,59.9 64.39,63.9 | 56.39,63.9 64.39,63.9 | 60.39,67.9 60.39,59.9 | 80.69,63.9 80.69,63.55 80.69,59.9 84.69,59.9 | 80.69,63.9 80.69,67.9 84.69,67.9 | 84.69,67.9 88.69,67.9 88.69,63.55 88.69,59.9 84.69,59.9 | 80.69,63.9 88.69,63.9 | 84.69,67.9 84.69,59.9 | 105.09,63.9 105.09,59.9 109.09,59.9 | 105.09,63.9 105.09,67.9 109.09,67.9 | 109.09,67.9 113.09,67.9 113.09,59.9 109.09,59.9 | 105.09,63.9 113.09,63.9 | 109.09,67.9 109.09,59.9
  Bottom 0.254: v64.4,55.31 64.4,54.42 JP3.3

### Text on the board
Top: Touch Pad Board (PCB A) ver. 1.00
Bottom: Touch Pad Board (PCB A) ver. 1.00
bNames: Touch Pad Board (PCB A) ver. 1.00
Reference: Touch Pad Board (PCB A) ver. 1.00